# Altium project SPEC_A7.PrjPcb (part 2 of 7)

## Sheet FPGA_14_15.SchDoc: SPEC-A7
size 420 x 297 mm; Author: G.Kasprowicz; CompanyName: WUT ISE; DrawnBy: G.Kasprowicz; Organization: WUT ISE; Address1: PW ISE; Address2: Nowowiejska 15/19 00-665 Warsaw; Address3: gkasprow@gmail.com; Revision: 2; SheetNumber: 3; SheetTotal: 18; ModifiedBy: -; CheckedDate: -; Title2: FPGA 14 &15; DivGrp: WUT ISE; Designer: G.Kasprowicz; ModifiedDate: -; ProjectName: Sensor Box
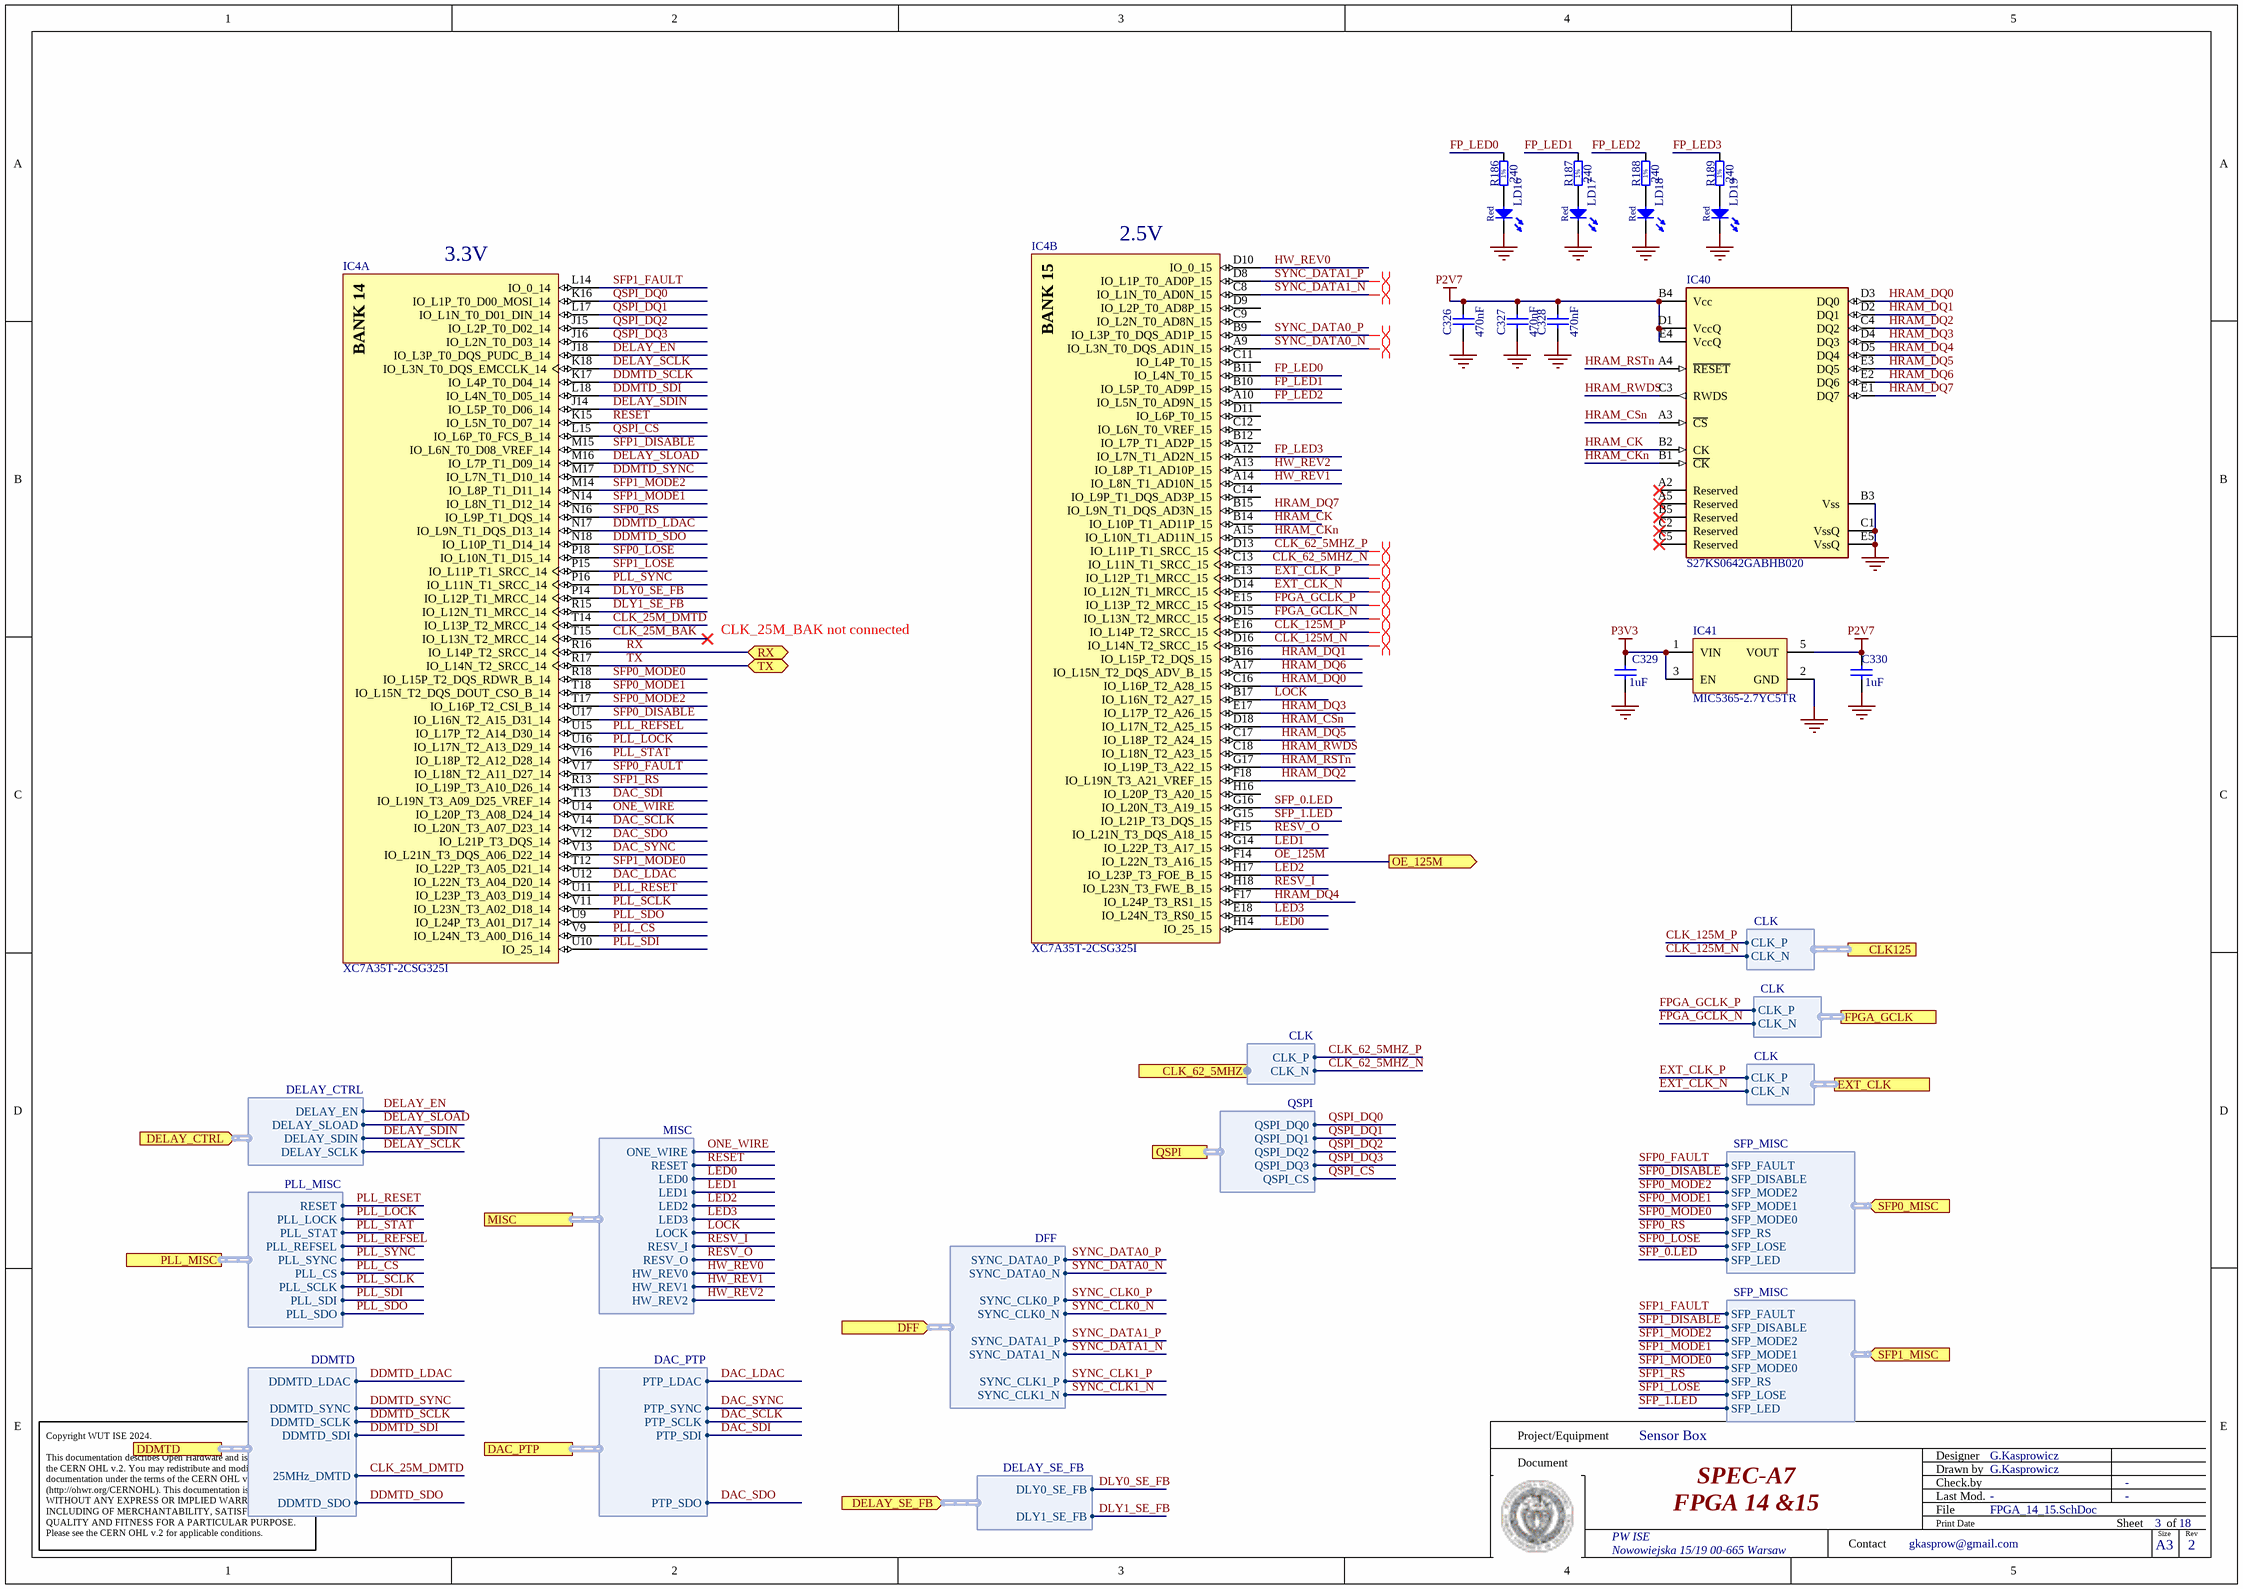
[diagram p2: FPGA_14_15.SchDoc]

### Parts
C326  470nF  [CAPC0603X33N]
C327  470nF  [CAPC0603X33N]
C328  470nF  [CAPC0603X33N]
C329  1uF  [CAPC1005X55N]
C330  1uF  [CAPC1005X55N]
IC4  XC7A35T-2CSG325I  [CSG325]  (parts A,B of 9)
IC40  S27KS0642GABHB020  [FP-PG-BGA-24-IPC_A]
IC41  MIC5365-2.7YC5TR  [SOT65P210X110-5N]
LD16  Red  [LED_AVAGO_HSMC-C120]
LD17  Red  [LED_AVAGO_HSMC-C120]
LD18  Red  [LED_AVAGO_HSMC-C120]
LD19  Red  [LED_AVAGO_HSMC-C120]
R186  240  [RESC1005X40N]
R187  240  [RESC1005X40N]
R188  240  [RESC1005X40N]
R189  240  [RESC1005X40N]

### Ports
CLK125 (harness CLK, see SPEC-A7-TOP[3C], FPGA_MGT[2C]), CLK_62_5MHZ (harness CLK, see SPEC-A7-TOP[3B], Clocks_PLL[5B]), DAC_PTP (harness DAC_PTP, see SPEC-A7-TOP[3C], VCXO_25M_PTP[1C]), DDMTD (harness DDMTD, see SPEC-A7-TOP[3C], VCXO_25M_DDMTD[1D]), DELAY_CTRL (in, harness DELAY_CTRL, see SPEC-A7-TOP[3C], DIFF_DELAY_FANOUT[5B]), DELAY_SE_FB (in, harness DELAY_SE_FB, see SPEC-A7-TOP[3C], DIFF_DELAY_FANOUT[5D]), DFF (in, harness DFF, see SPEC-A7-TOP[3C], Clocks_PLL[3C], DIFF_DELAY_FANOUT[5C]), EXT_CLK (harness CLK, see SPEC-A7-TOP[3B], Clocks_PLL[3B]), FPGA_GCLK (harness CLK, see SPEC-A7-TOP[3B], Clocks_PLL[3B]), MISC (harness MISC, see SPEC-A7-TOP[3C], Misc[2C]), OE_125M (out, see SPEC-A7-TOP[3C], XO_125M[1D]), PLL_MISC (harness PLL_MISC, see SPEC-A7-TOP[3B], Clocks_PLL[5D]), QSPI (harness QSPI, see SPEC-A7-TOP[3C], FPGA_PWR_CONFIG[3E]), RX (bidir, see SPEC-A7-TOP[3C]), SFP0_MISC (in, harness SFP_MISC, see SPEC-A7-TOP[3B], SFP[4B]), SFP1_MISC (in, harness SFP_MISC, see SPEC-A7-TOP[3B], SFP[4C]), TX (bidir, see SPEC-A7-TOP[3C])

### Harnesses
DDMTD: DDMTD_LDAC, DDMTD_SYNC, DDMTD_SCLK, DDMTD_SDI, DDMTD_SDO, 25MHz_DMTD
DAC_PTP: PTP_LDAC, PTP_SYNC, PTP_SCLK, PTP_SDI, PTP_SDO
PLL_MISC: RESET, PLL_LOCK, PLL_STAT, PLL_REFSEL, PLL_SYNC, PLL_CS, PLL_SCLK, PLL_SDI, PLL_SDO
DELAY_CTRL: DELAY_EN, DELAY_SLOAD, DELAY_SDIN, DELAY_SCLK
DFF: SYNC_DATA0_P, SYNC_DATA0_N, SYNC_CLK0_P, SYNC_CLK0_N, SYNC_DATA1_P, SYNC_DATA1_N, SYNC_CLK1_P, SYNC_CLK1_N
DELAY_SE_FB: DLY0_SE_FB, DLY1_SE_FB
MISC: ONE_WIRE, RESET, LED0, LED1, LED2, LED3, LOCK, RESV_I, RESV_O, HW_REV0, HW_REV1, HW_REV2
QSPI: QSPI_DQ0, QSPI_DQ1, QSPI_DQ2, QSPI_DQ3, QSPI_CS
CLK: CLK_P, CLK_N
SFP_MISC: SFP_FAULT, SFP_DISABLE, SFP_MODE2, SFP_MODE1, SFP_MODE0, SFP_RS, SFP_LOSE, SFP_LED

### Nets
GND: C326.1 C327.1 C328.1 C329.1 C330.1 IC40.B3(Vss) IC40.C1(VssQ) IC40.E5(VssQ) IC41.2(GND) LD16.1(C) LD17.1(C) LD18.1(C) LD19.1(C)
P2V7: C326.2 C327.2 C328.2 C330.2 IC40.B4(Vcc) IC40.D1(VccQ) IC40.E4(VccQ) IC41.5(VOUT)
P3V3: C329.2 IC41.1(VIN) IC41.3(EN)
CLK_25M_BAK: IC4.T15(IO_L13N_T2_MRCC_14)
CLK_25M_DMTD: IC4.T14(IO_L13P_T2_MRCC_14) ; port DDMTD.25MHz_DMTD
CLK_62_5MHZ_N: IC4.C13(IO_L11N_T1_SRCC_15) ; port CLK_62_5MHZ.CLK_N  [project net 62_5MHZ_N]
CLK_62_5MHZ_P: IC4.D13(IO_L11P_T1_SRCC_15) ; port CLK_62_5MHZ.CLK_P  [project net 62_5MHZ_P]
CLK_125M_N: IC4.D16(IO_L14N_T2_SRCC_15) ; port CLK125.CLK_N
CLK_125M_P: IC4.E16(IO_L14P_T2_SRCC_15) ; port CLK125.CLK_P
DAC_LDAC: IC4.U12(IO_L22N_T3_A04_D20_14) ; port DAC_PTP.PTP_LDAC
DAC_SCLK: IC4.V14(IO_L20N_T3_A07_D23_14) ; port DAC_PTP.PTP_SCLK
DAC_SDI: IC4.T13(IO_L19N_T3_A09_D25_VREF_14) ; port DAC_PTP.PTP_SDI
DAC_SDO: IC4.V12(IO_L21P_T3_DQS_14) ; port DAC_PTP.PTP_SDO
DAC_SYNC: IC4.V13(IO_L21N_T3_DQS_A06_D22_14) ; port DAC_PTP.PTP_SYNC
DDMTD_LDAC: IC4.N17(IO_L9N_T1_DQS_D13_14) ; port DDMTD.DDMTD_LDAC
DDMTD_SCLK: IC4.K17(IO_L4P_T0_D04_14) ; port DDMTD.DDMTD_SCLK
DDMTD_SDI: IC4.L18(IO_L4N_T0_D05_14) ; port DDMTD.DDMTD_SDI
DDMTD_SDO: IC4.N18(IO_L10P_T1_D14_14) ; port DDMTD.DDMTD_SDO
DDMTD_SYNC: IC4.M17(IO_L7N_T1_D10_14) ; port DDMTD.DDMTD_SYNC
DELAY_EN: IC4.J18(IO_L3P_T0_DQS_PUDC_B_14) ; port DELAY_CTRL.DELAY_EN
DELAY_SCLK: IC4.K18(IO_L3N_T0_DQS_EMCCLK_14) ; port DELAY_CTRL.DELAY_SCLK
DELAY_SDIN: IC4.J14(IO_L5P_T0_D06_14) ; port DELAY_CTRL.DELAY_SDIN
DELAY_SLOAD: IC4.M16(IO_L7P_T1_D09_14) ; port DELAY_CTRL.DELAY_SLOAD
DLY0_SE_FB: IC4.P14(IO_L12P_T1_MRCC_14) ; port DELAY_SE_FB.DLY0_SE_FB
DLY1_SE_FB: IC4.R15(IO_L12N_T1_MRCC_14) ; port DELAY_SE_FB.DLY1_SE_FB
EXT_CLK_N: IC4.D14(IO_L12N_T1_MRCC_15) ; port EXT_CLK.CLK_N
EXT_CLK_P: IC4.E13(IO_L12P_T1_MRCC_15) ; port EXT_CLK.CLK_P
FP_LED0: IC4.B11(IO_L4N_T0_15) R186.2
FP_LED1: IC4.B10(IO_L5P_T0_AD9P_15) R187.2
FP_LED2: IC4.A10(IO_L5N_T0_AD9N_15) R188.2
FP_LED3: IC4.A12(IO_L7N_T1_AD2N_15) R189.2
FPGA_GCLK_N: IC4.D15(IO_L13N_T2_MRCC_15) ; port FPGA_GCLK.CLK_N
FPGA_GCLK_P: IC4.E15(IO_L13P_T2_MRCC_15) ; port FPGA_GCLK.CLK_P
HRAM_CK: IC4.B14(IO_L10P_T1_AD11P_15) IC40.B2(CK)
HRAM_CKn: IC4.A15(IO_L10N_T1_AD11N_15) IC40.B1(~{CK})
HRAM_CSn: IC4.D18(IO_L17N_T2_A25_15) IC40.A3(~{CS})
HRAM_DQ0: IC4.C16(IO_L16P_T2_A28_15) IC40.D3(DQ0)
HRAM_DQ1: IC4.B16(IO_L15P_T2_DQS_15) IC40.D2(DQ1)
HRAM_DQ2: IC4.F18(IO_L19N_T3_A21_VREF_15) IC40.C4(DQ2)
HRAM_DQ3: IC4.E17(IO_L17P_T2_A26_15) IC40.D4(DQ3)
HRAM_DQ4: IC4.F17(IO_L24P_T3_RS1_15) IC40.D5(DQ4)
HRAM_DQ5: IC4.C17(IO_L18P_T2_A24_15) IC40.E3(DQ5)
HRAM_DQ6: IC4.A17(IO_L15N_T2_DQS_ADV_B_15) IC40.E2(DQ6)
HRAM_DQ7: IC4.B15(IO_L9N_T1_DQS_AD3N_15) IC40.E1(DQ7)
HRAM_RSTn: IC4.G17(IO_L19P_T3_A22_15) IC40.A4(~{RESET})
HRAM_RWDS: IC4.C18(IO_L18N_T2_A23_15) IC40.C3(RWDS)
HW_REV0: IC4.D10(IO_0_15) ; port MISC.HW_REV0
HW_REV1: IC4.A14(IO_L8N_T1_AD10N_15) ; port MISC.HW_REV1
HW_REV2: IC4.A13(IO_L8P_T1_AD10P_15) ; port MISC.HW_REV2
LED0: IC4.H14(IO_25_15) ; port MISC.LED0
LED1: IC4.G14(IO_L22P_T3_A17_15) ; port MISC.LED1
LED2: IC4.H17(IO_L23P_T3_FOE_B_15) ; port MISC.LED2
LED3: IC4.E18(IO_L24N_T3_RS0_15) ; port MISC.LED3
LOCK: IC4.B17(IO_L16N_T2_A27_15) ; port MISC.LOCK
OE_125M: IC4.F14(IO_L22N_T3_A16_15) ; port OE_125M
ONE_WIRE: IC4.U14(IO_L20P_T3_A08_D24_14) ; port MISC.ONE_WIRE
PLL_CS: IC4.V9(IO_L24N_T3_A00_D16_14) ; port PLL_MISC.PLL_CS
PLL_LOCK: IC4.U16(IO_L17N_T2_A13_D29_14) ; port PLL_MISC.PLL_LOCK
PLL_REFSEL: IC4.U15(IO_L17P_T2_A14_D30_14) ; port PLL_MISC.PLL_REFSEL
PLL_RESET: IC4.U11(IO_L23P_T3_A03_D19_14) ; port PLL_MISC.RESET
PLL_SCLK: IC4.V11(IO_L23N_T3_A02_D18_14) ; port PLL_MISC.PLL_SCLK
PLL_SDI: IC4.U10(IO_25_14) ; port PLL_MISC.PLL_SDI
PLL_SDO: IC4.U9(IO_L24P_T3_A01_D17_14) ; port PLL_MISC.PLL_SDO
PLL_STAT: IC4.V16(IO_L18P_T2_A12_D28_14) ; port PLL_MISC.PLL_STAT
PLL_SYNC: IC4.P16(IO_L11N_T1_SRCC_14) ; port PLL_MISC.PLL_SYNC
QSPI_CS: IC4.L15(IO_L6P_T0_FCS_B_14) ; port QSPI.QSPI_CS
QSPI_DQ0: IC4.K16(IO_L1P_T0_D00_MOSI_14) ; port QSPI.QSPI_DQ0
QSPI_DQ1: IC4.L17(IO_L1N_T0_D01_DIN_14) ; port QSPI.QSPI_DQ1
QSPI_DQ2: IC4.J15(IO_L2P_T0_D02_14) ; port QSPI.QSPI_DQ2
QSPI_DQ3: IC4.J16(IO_L2N_T0_D03_14) ; port QSPI.QSPI_DQ3
RESET: IC4.K15(IO_L5N_T0_D07_14) ; port MISC.RESET
RESV_I: IC4.H18(IO_L23N_T3_FWE_B_15) ; port MISC.RESV_I
RESV_O: IC4.F15(IO_L21N_T3_DQS_A18_15) ; port MISC.RESV_O
RX: IC4.R16(IO_L14P_T2_SRCC_14) ; port RX
SFP0_DISABLE: IC4.U17(IO_L16N_T2_A15_D31_14) ; port SFP0_MISC.SFP_DISABLE
SFP0_FAULT: IC4.V17(IO_L18N_T2_A11_D27_14) ; port SFP0_MISC.SFP_FAULT
SFP0_LOSE: IC4.P18(IO_L10N_T1_D15_14) ; port SFP0_MISC.SFP_LOSE
SFP0_MODE0: IC4.R18(IO_L15P_T2_DQS_RDWR_B_14) ; port SFP0_MISC.SFP_MODE0
SFP0_MODE1: IC4.T18(IO_L15N_T2_DQS_DOUT_CSO_B_14) ; port SFP0_MISC.SFP_MODE1
SFP0_MODE2: IC4.T17(IO_L16P_T2_CSI_B_14) ; port SFP0_MISC.SFP_MODE2
SFP0_RS: IC4.N16(IO_L9P_T1_DQS_14) ; port SFP0_MISC.SFP_RS
SFP1_DISABLE: IC4.M15(IO_L6N_T0_D08_VREF_14) ; port SFP1_MISC.SFP_DISABLE
SFP1_FAULT: IC4.L14(IO_0_14) ; port SFP1_MISC.SFP_FAULT
SFP1_LOSE: IC4.P15(IO_L11P_T1_SRCC_14) ; port SFP1_MISC.SFP_LOSE
SFP1_MODE0: IC4.T12(IO_L22P_T3_A05_D21_14) ; port SFP1_MISC.SFP_MODE0
SFP1_MODE1: IC4.N14(IO_L8N_T1_D12_14) ; port SFP1_MISC.SFP_MODE1
SFP1_MODE2: IC4.M14(IO_L8P_T1_D11_14) ; port SFP1_MISC.SFP_MODE2
SFP1_RS: IC4.R13(IO_L19P_T3_A10_D26_14) ; port SFP1_MISC.SFP_RS
SFP_0.LED: IC4.G16(IO_L20N_T3_A19_15) ; port SFP0_MISC.SFP_LED
SFP_1.LED: IC4.G15(IO_L21P_T3_DQS_15) ; port SFP1_MISC.SFP_LED
SYNC_DATA0_N: IC4.A9(IO_L3N_T0_DQS_AD1N_15) ; port DFF.SYNC_DATA0_N
SYNC_DATA0_P: IC4.B9(IO_L3P_T0_DQS_AD1P_15) ; port DFF.SYNC_DATA0_P
SYNC_DATA1_N: IC4.C8(IO_L1N_T0_AD0N_15) ; port DFF.SYNC_DATA1_N
SYNC_DATA1_P: IC4.D8(IO_L1P_T0_AD0P_15) ; port DFF.SYNC_DATA1_P
TX: IC4.R17(IO_L14N_T2_SRCC_14) ; port TX
NetLD16_2: LD16.2(A) R186.1
NetLD17_2: LD17.2(A) R187.1
NetLD18_2: LD18.2(A) R188.1
NetLD19_2: LD19.2(A) R189.1

Not connected (* = marked no-connect by the designer): IC4 B12(IO_L7P_T1_AD2P_15) C9(IO_L2N_T0_AD8N_15) C11(IO_L4P_T0_15) C12(IO_L6N_T0_VREF_15) C14(IO_L9P_T1_DQS_AD3P_15) D9(IO_L2P_T0_AD8P_15) D11(IO_L6P_T0_15) H16(IO_L20P_T3_A20_15); IC40 A2(Reserved)* A5(Reserved)* B5(Reserved)* C2(Reserved)* C5(Reserved)*

### Layout directives
differential pair: 62_5MHZ_N, 62_5MHZ_P, CLK_125M_N, CLK_125M_P, EXT_CLK_N, EXT_CLK_P, FPGA_GCLK_N, FPGA_GCLK_P, SYNC_DATA0_N, SYNC_DATA0_P, SYNC_DATA1_N, SYNC_DATA1_P

### Notes on the sheet
- 3.3V
- 2.5V
- CLK_25M_BAK not connected
- Project/Equipment
- Document
- Designer
- Drawn by
- Check.by
- Copyright WUT ISE 2024.
  This documentation describes Open Hardware and is licensed under the CERN OHL v.2. You may redistribute and modify this documentation under the terms of the CERN OHL v.2. (http://ohwr.org/CERNOHL). This documentation is distributed WITHOUT ANY EXPRESS OR IMPLIED WARRANTY, INCLUDING OF MERCHANTABILITY, SATISFACTORY QUALITY AND FITNESS FOR A PARTICULAR PURPOSE. Please see the CERN OHL v.2 for applicable conditions.
- Contact
- File
- Last Mod.
- Print Date
- Sheet
- Size
- A3
- of
- Rev
- (in symbol CMP-0383-00003-1, part A) BANK 14
- (in symbol CMP-0383-00003-1, part B) BANK 15
- (in symbol R0402_240R_1%_0.0625W_100PPM) 1%

### Library data of the parts
C326-C328 = CC0201_470NF_4V_20%_X5R: as C233 on sheet Clocks_PLL; Part Number: CC0201_470NF_4V_20%_X5R; Component Kind: Standard; Component Type: Standard; Pin Count: 2; Value: 470nF; Status: Not Recommended; Manufacturer Part Number: CC0201_470NF_4V_20%_X5R; Case: 0201; Mounted: Yes; Socket: No; SMD: Yes; Sense: No; Manufacturer1 Example: TAIYO YUDEN; Manufacturer1 ComponentHeight: 0.33mm; HelpURL: \\cern.ch\dfs\Applications\Altium\Datasheets\CC0201_X5R_TAIYO-YUDEN_STANDARD-CLASS2.pdf; Author: CERN DEM JLC; CreateDate: 27.05.2010; LatestRevisionDate: 27.05.2010
C329 C330 = CC0402_1UF_16V_10%_X5R: as C225 on sheet Clocks_PLL; Part Number: CC0402_1UF_16V_10%_X5R; Component Kind: Standard; Component Type: Standard; Pin Count: 2; Value: 1uF; Status: Preferred; Manufacturer Part Number: CC0402_1UF_16V_10%_X5R; Case: 0402; Mounted: Yes; Socket: No; SMD: Yes; Sense: No; Manufacturer1 Example: TDK; Manufacturer1 ComponentHeight: 0.55mm; HelpURL: \\cern.ch\dfs\Applications\Altium\Datasheets\CC0402_X5R_TDK_C.pdf; Author: CERN DEM JLC; CreateDate: 25.10.2012; LatestRevisionDate: 25.10.2012
IC4 = CMP-0383-00003-1: Artix-7 FPGA, 150 User I/Os, 4 GTP, 324-Ball BGA, Speed Grade 2, Industrial Grade, Pb-Free; Manufacturer: Xilinx; Available User I/O: 150; Speed Grades: 2; GTP: 4; Logic Cells: 33280; Total Block RAM: 1800 Kb; CMTs: 5; ComponentLink3URL: http://www.xilinx.com/support/documentation/user_guides/ug475_7Series_Pkg_Pinout.pdf; Maximum Distributed RAM: 400 Kb; Operating Temperature Range: Industrial; ComponentLink1URL: http://www.xilinx.com/; Mounting Technology: Surface Mount; ComponentLink1Description: Manufacturer URL; ComponentLink2Description: Datasheet; PartNumber: XC7A35T-2CSG325I; PackageVersion: Rev. 1.11; PackageDescription: 324-Ball Wire-Bond Chip-Scale BGA, Body 15 x 15 mm, Pitch 0.8 mm; DatasheetVersion: Rev. 1.15; PackageReference: CSG-325; ComponentLink3Description: Pinout; ComponentLink4Description: Package Specification; ComponentLink2URL: http://www.xilinx.com/support/documentation/data_sheets/ds180_7Series_Overview.pdf; ComponentLink4URL: http://www.xilinx.com/support/documentation/user_guides/ug475_7Series_Pkg_Pinout.pdf
IC40 = CMP-32844-000028-1: IC PSRAM 64MBIT HYPERBUS 24FBGA
LD16-LD19 = LED_AVAGO_HSMC-C120: LED Red 1C 2A; Part Description: High Performance Right Angle Chip Red LED; Manufacturer: AVAGO TECHNOLOGIES; PressFit: No; Bonding: No; Part Number: LED_AVAGO_HSMC-C120; Component Kind: Standard; Component Type: Standard; Color: Red; PackageDescription: Red Chip LED, 2-Leads, Body 1.7x1.1mm, Side Emitting Package; Manufacturer Part Number: HSMC-C120; Pin Count: 2; Mounted: Yes; Socket: No; SMD: Yes; Sense: No; ComponentHeight: 0.7mm; HelpURL: \\cern.ch\dfs\Applications\Altium\Datasheets\LED_AVAGO_HSMC-C120.pdf; ComponentLink1URL: \\cern.ch\dfs\Applications\Altium\Datasheets\LED_AVAGO_HSMC-C120_DESIGN-GUIDE.pdf; ComponentLink1Description: Design Guide; Author: CERN DEM JMW; CreateDate: 22.07.2009; LatestRevisionDate: 20.06.2012
R186-R189 = R0402_240R_1%_0.0625W_100PPM: Resistor - 1%; Part Description: General Purpose Thick Film Chip Resistor; Manufacturer: GENERIC; Manufacturer1 Part Number: 232270672401L; TC: ±100ppm/°C; PressFit: No; Part Number: R0402_240R_1%_0.0625W_100PPM; Component Kind: Standard; Component Type: Standard; Pin Count: 2; Value: 240; Status: Not Recommended; Power: 0.0625W; Tolerance: ±1%; Manufacturer Part Number: R0402_240R_1%_0.0625W_100PPM; Case: 0402; Mounted: Yes; Sense: No; Socket: No; SMD: Yes; Manufacturer1 Example: YAGEO PHYCOMP; Manufacturer1 ComponentHeight: 0.4mm; HelpURL: \\cern.ch\dfs\Applications\Altium\Datasheets\R0402_Phycomp_RC0402.pdf; Author: CERN DEM JLC; CreateDate: 03.12.2007; LatestRevisionDate: 17.10.2012

## Sheet DIFF_DELAY_FANOUT.SchDoc: SPEC-A7
size 420 x 297 mm; Author: G.Kasprowicz; CompanyName: WUT ISE; DrawnBy: G.Kasprowicz; Organization: WUT ISE; Address1: PW ISE; Address2: Nowowiejska 15/19 00-665 Warsaw; Address3: gkasprow@gmail.com; Revision: 2; SheetNumber: 11; SheetTotal: 18; ModifiedBy: -; CheckedDate: -; Title2: Delay & outputs; DivGrp: WUT ISE; Designer: G.Kasprowicz; ModifiedDate: -; ProjectName: Sensor Box
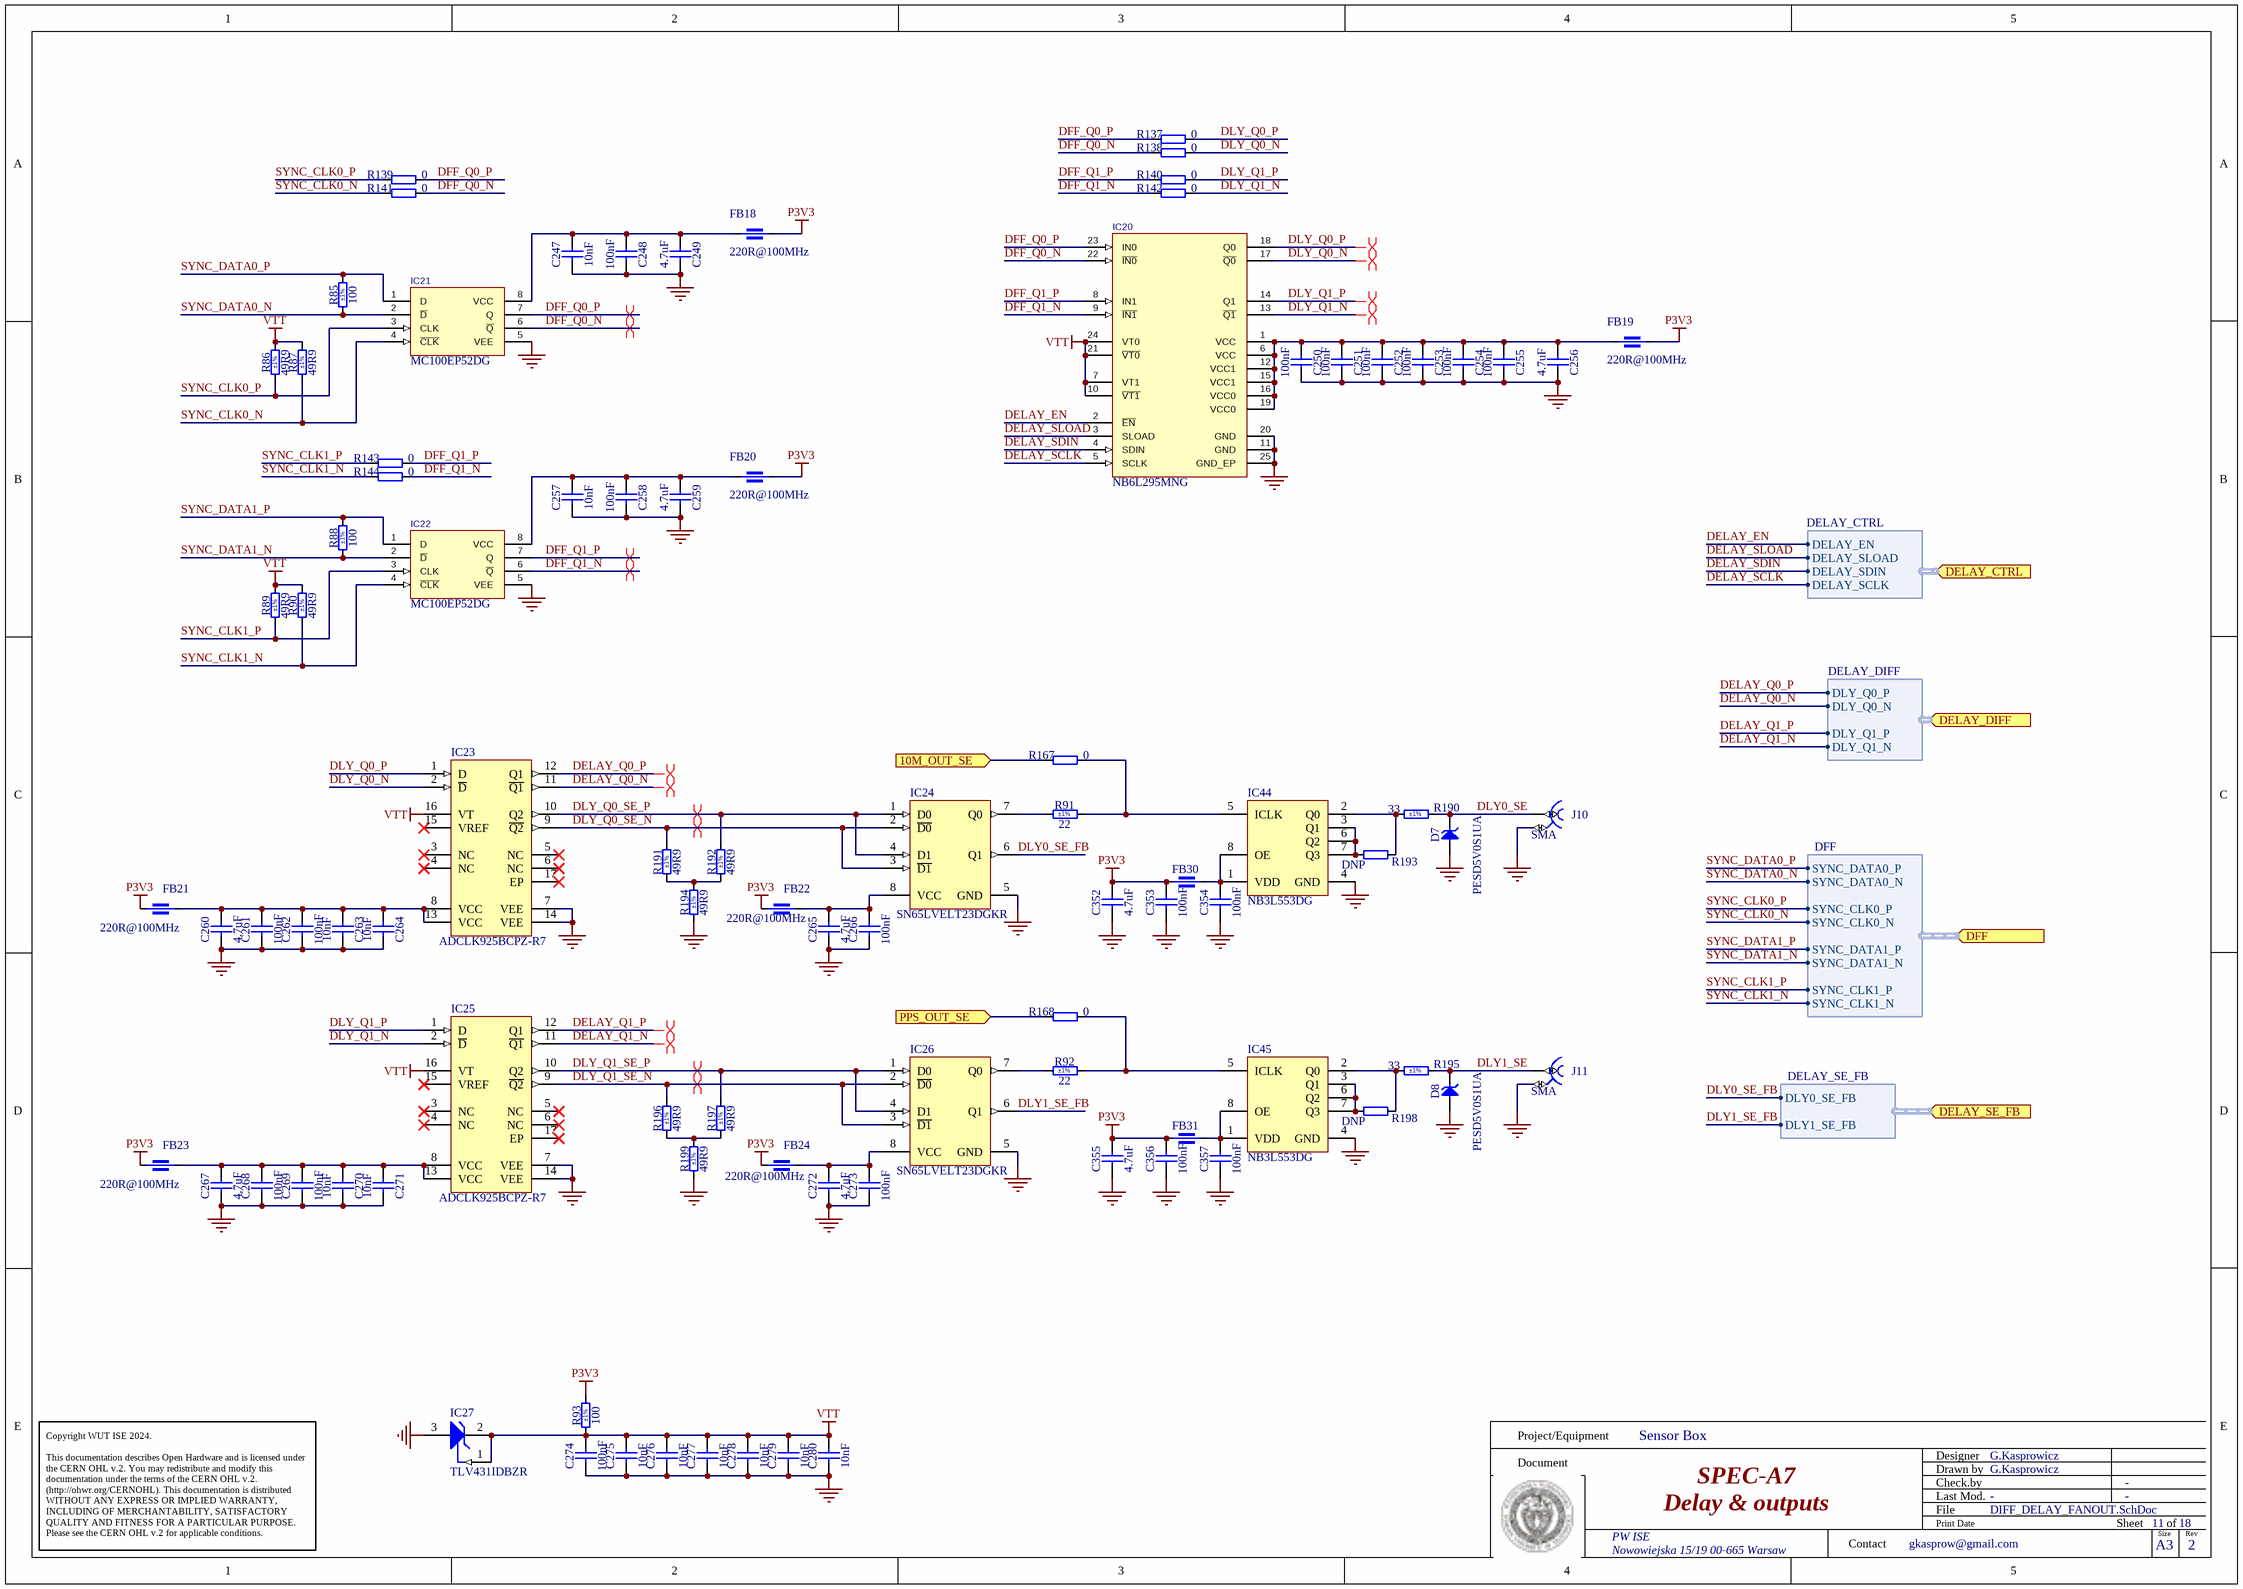
[diagram p3: DIFF_DELAY_FANOUT.SchDoc]

### Parts
C247  10nF  [CAPC1005X55N]
C248  100nF  [CAPC0603X33N]
C249  4.7uF  [CAPC1005X55N]
C250  100nF  [CAPC0603X33N]
C251  100nF  [CAPC0603X33N]
C252  100nF  [CAPC0603X33N]
C253  100nF  [CAPC0603X33N]
C254  100nF  [CAPC0603X33N]
C255  100nF  [CAPC0603X33N]
C256  4.7uF  [CAPC1005X55N]
C257  10nF  [CAPC1005X55N]
C258  100nF  [CAPC0603X33N]
C259  4.7uF  [CAPC1005X55N]
C260  4.7uF  [CAPC1005X55N]
C261  100nF  [CAPC0603X33N]
C262  100nF  [CAPC0603X33N]
C263  10nF  [CAPC1005X55N]
C264  10nF  [CAPC1005X55N]
C265  4.7uF  [CAPC1005X55N]
C266  100nF  [CAPC0603X33N]
C267  4.7uF  [CAPC1005X55N]
C268  100nF  [CAPC0603X33N]
C269  100nF  [CAPC0603X33N]
C270  10nF  [CAPC1005X55N]
C271  10nF  [CAPC1005X55N]
C272  4.7uF  [CAPC1005X55N]
C273  100nF  [CAPC0603X33N]
C274  100nF  [CAPC0603X33N]
C275  10nF  [CAPC1005X55N]
C276  10nF  [CAPC1005X55N]
C277  10nF  [CAPC1005X55N]
C278  10nF  [CAPC1005X55N]
C279  10nF  [CAPC1005X55N]
C280  10nF  [CAPC1005X55N]
C352  4.7uF  [CAPC1005X55N]
C353  100nF  [CAPC0603X33N]
C354  100nF  [CAPC0603X33N]
C355  4.7uF  [CAPC1005X55N]
C356  100nF  [CAPC0603X33N]
C357  100nF  [CAPC0603X33N]
D7  PESD5V0S1UA  [SOD2512X110N]
D8  PESD5V0S1UA  [SOD2512X110N]
FB18  220R@100MHz  [INDC1608X95N]
FB19  220R@100MHz  [INDC1608X95N]
FB20  220R@100MHz  [INDC1608X95N]
FB21  220R@100MHz  [INDC1608X95N]
FB22  220R@100MHz  [INDC1608X95N]
FB23  220R@100MHz  [INDC1608X95N]
FB24  220R@100MHz  [INDC1608X95N]
FB30  220R@100MHz  [INDC1608X95N]  (value not drawn)
FB31  220R@100MHz  [INDC1608X95N]  (value not drawn)
IC20  NB6L295MNG  [QFN50P400X400X80-25N-S280]
IC21  MC100EP52DG  [SOIC127P600X175-8N]
IC22  MC100EP52DG  [SOIC127P600X175-8N]
IC23  ADCLK925BCPZ-R7  [ADI-CP-16-3_L]
IC24  SN65LVELT23DGKR  [DGK0008A_L]
IC25  ADCLK925BCPZ-R7  [ADI-CP-16-3_L]
IC26  SN65LVELT23DGKR  [DGK0008A_L]
IC27  TLV431IDBZR  [DBZ0003A_N]
IC44  NB3L553DG  [SOIC127P600X175-8N]
IC45  NB3L553DG  [SOIC127P600X175-8N]
J10  SMA  [DELOCK_65848]
J11  SMA  [DELOCK_65848]
R85  100  Tolerance: ±1%  [RESC1005X40N]
R86  49R9  Tolerance: ±1%  [RESC1005X40N]
R87  49R9  Tolerance: ±1%  [RESC1005X40N]
R88  100  Tolerance: ±1%  [RESC1005X40N]
R89  49R9  Tolerance: ±1%  [RESC1005X40N]
R90  49R9  Tolerance: ±1%  [RESC1005X40N]
R91  22  Tolerance: ±1%  [RESC1005X40N]
R92  22  Tolerance: ±1%  [RESC1005X40N]
R93  100  Tolerance: ±1%  [RESC1005X40N]
R137  0  [RESC1005X40N]  (no BOM)
R138  0  [RESC1005X40N]  (no BOM)
R139  0  [RESC1005X40N]  (no BOM)
R140  0  [RESC1005X40N]  (no BOM)
R141  0  [RESC1005X40N]  (no BOM)
R142  0  [RESC1005X40N]  (no BOM)
R143  0  [RESC1005X40N]  (no BOM)
R144  0  [RESC1005X40N]  (no BOM)
R167  0  [RESC1005X40N]  (no BOM)
R168  0  [RESC1005X40N]  (no BOM)
R190  33  Tolerance: ±1%  [RESC2012X60N]
R191  49R9  Tolerance: ±1%  [RESC1005X40N]
R192  49R9  Tolerance: ±1%  [RESC1005X40N]
R193  DNP  [RESC1005X40N]  (no BOM)
R194  49R9  Tolerance: ±1%  [RESC1005X40N]
R195  33  Tolerance: ±1%  [RESC2012X60N]
R196  49R9  Tolerance: ±1%  [RESC1005X40N]
R197  49R9  Tolerance: ±1%  [RESC1005X40N]
R198  DNP  [RESC1005X40N]  (no BOM)
R199  49R9  Tolerance: ±1%  [RESC1005X40N]

### Ports
10M_OUT_SE (in, see SPEC-A7-TOP[2C], FPGA_34[2C]), DELAY_CTRL (in, harness DELAY_CTRL, see SPEC-A7-TOP[2C], FPGA_14_15[1D]), DELAY_DIFF (in, harness DELAY_DIFF, see SPEC-A7-TOP[2C], Ext_connectors[2C]), DELAY_SE_FB (in, harness DELAY_SE_FB, see SPEC-A7-TOP[2C], FPGA_14_15[2E]), DFF (in, harness DFF, see SPEC-A7-TOP[2C], Clocks_PLL[3C], FPGA_14_15[2E]), PPS_OUT_SE (in, see SPEC-A7-TOP[2C], FPGA_34[2C])

### Harnesses
DFF: SYNC_DATA0_P, SYNC_DATA0_N, SYNC_CLK0_P, SYNC_CLK0_N, SYNC_DATA1_P, SYNC_DATA1_N, SYNC_CLK1_P, SYNC_CLK1_N
DELAY_DIFF: DLY_Q0_P, DLY_Q0_N, DLY_Q1_P, DLY_Q1_N
DELAY_CTRL: DELAY_EN, DELAY_SLOAD, DELAY_SDIN, DELAY_SCLK
DELAY_SE_FB: DLY0_SE_FB, DLY1_SE_FB

### Nets
GND: C247.1 C248.1 C249.1 C250.1 C251.1 C252.1 C253.1 C254.1 C255.1 C256.1 C257.1 C258.1 C259.1 C260.1 C261.1 C262.1 C263.1 C264.1 C265.1 C266.1 C267.1 C268.1 C269.1 C270.1 C271.1 C272.1 C273.1 C274.1 C275.1 C276.1 C277.1 C278.1 C279.1 C280.1 C352.1 C353.1 C354.1 C355.1 C356.1 C357.1 D7.2(A) D8.2(A) IC20.11(GND) IC20.20(GND) IC20.25(GND_EP) IC21.5(VEE) IC22.5(VEE) IC23.7(VEE) IC23.14(VEE) IC24.5(GND) IC25.7(VEE) IC25.14(VEE) IC26.5(GND) IC27.3(ANODE) IC44.4(GND) IC45.4(GND) J10.2 J11.2 R194.1 R199.1
P3V3: C352.2 C353.2 C355.2 C356.2 FB18.1 FB19.1 FB20.1 FB21.1 FB22.1 FB23.1 FB24.1 FB30.1 FB31.1 R93.2
VTT: C274.2 C275.2 C276.2 C277.2 C278.2 C279.2 C280.2 IC20.7(VT1) IC20.10(~{VT1}) IC20.21(~{VT0}) IC20.24(VT0) IC23.16(VT) IC25.16(VT) IC27.1(REF) IC27.2(CATHODE) R86.2 R87.2 R89.2 R90.2 R93.1
10M_OUT_SE: R167.1 ; port 10M_OUT_SE
DELAY_EN: IC20.2(~{EN}) ; port DELAY_CTRL.DELAY_EN
DELAY_Q0_N: IC23.11(~{Q1}) ; port DELAY_DIFF.DLY_Q0_N
DELAY_Q0_P: IC23.12(Q1) ; port DELAY_DIFF.DLY_Q0_P
DELAY_Q1_N: IC25.11(~{Q1}) ; port DELAY_DIFF.DLY_Q1_N
DELAY_Q1_P: IC25.12(Q1) ; port DELAY_DIFF.DLY_Q1_P
DELAY_SCLK: IC20.5(SCLK) ; port DELAY_CTRL.DELAY_SCLK
DELAY_SDIN: IC20.4(SDIN) ; port DELAY_CTRL.DELAY_SDIN
DELAY_SLOAD: IC20.3(SLOAD) ; port DELAY_CTRL.DELAY_SLOAD
DFF_Q0_N: IC20.22(~{IN0}) IC21.6(~{Q}) R138.1 R141.2
DFF_Q0_P: IC20.23(IN0) IC21.7(Q) R137.1 R139.2
DFF_Q1_N: IC20.9(~{IN1}) IC22.6(~{Q}) R142.1 R144.2
DFF_Q1_P: IC20.8(IN1) IC22.7(Q) R140.1 R143.2
DLY0_SE: D7.1(C) J10.1 R190.1
DLY0_SE_FB: IC24.6(Q1) ; port DELAY_SE_FB.DLY0_SE_FB
DLY1_SE: D8.1(C) J11.1 R195.1
DLY1_SE_FB: IC26.6(Q1) ; port DELAY_SE_FB.DLY1_SE_FB
DLY_Q0_N: IC20.17(~{Q0}) IC23.2(~{D}) R138.2
DLY_Q0_P: IC20.18(Q0) IC23.1(D) R137.2
DLY_Q0_SE_N: IC23.9(~{Q2}) IC24.2(~{D0}) IC24.3(~{D1}) R191.2
DLY_Q0_SE_P: IC23.10(Q2) IC24.1(D0) IC24.4(D1) R192.2
DLY_Q1_N: IC20.13(~{Q1}) IC25.2(~{D}) R142.2
DLY_Q1_P: IC20.14(Q1) IC25.1(D) R140.2
DLY_Q1_SE_N: IC25.9(~{Q2}) IC26.2(~{D0}) IC26.3(~{D1}) R196.2
DLY_Q1_SE_P: IC25.10(Q2) IC26.1(D0) IC26.4(D1) R197.2
PPS_OUT_SE: R168.1 ; port PPS_OUT_SE
SYNC_CLK0_N: IC21.4(~{CLK}) R87.1 R141.1 ; port DFF.SYNC_CLK0_N  [project net OUT_2_N]
SYNC_CLK0_P: IC21.3(CLK) R86.1 R139.1 ; port DFF.SYNC_CLK0_P  [project net OUT_2_P]
SYNC_CLK1_N: IC22.4(~{CLK}) R90.1 R144.1 ; port DFF.SYNC_CLK1_N  [project net OUT_3_N]
SYNC_CLK1_P: IC22.3(CLK) R89.1 R143.1 ; port DFF.SYNC_CLK1_P  [project net OUT_3_P]
SYNC_DATA0_N: IC21.2(~{D}) R85.1 ; port DFF.SYNC_DATA0_N
SYNC_DATA0_P: IC21.1(D) R85.2 ; port DFF.SYNC_DATA0_P
SYNC_DATA1_N: IC22.2(~{D}) R88.1 ; port DFF.SYNC_DATA1_N
SYNC_DATA1_P: IC22.1(D) R88.2 ; port DFF.SYNC_DATA1_P
NetC247_2: C247.2 C248.2 C249.2 FB18.2 IC21.8(VCC)
NetC250_2: C250.2 C251.2 C252.2 C253.2 C254.2 C255.2 C256.2 FB19.2 IC20.1(VCC) IC20.6(VCC) IC20.12(VCC1) IC20.15(VCC1) IC20.16(VCC0) IC20.19(VCC0)
NetC257_2: C257.2 C258.2 C259.2 FB20.2 IC22.8(VCC)
NetC260_2: C260.2 C261.2 C262.2 C263.2 C264.2 FB21.2 IC23.8(VCC) IC23.13(VCC)
NetC265_2: C265.2 C266.2 FB22.2 IC24.8(VCC)
NetC267_2: C267.2 C268.2 C269.2 C270.2 C271.2 FB23.2 IC25.8(VCC) IC25.13(VCC)
NetC272_2: C272.2 C273.2 FB24.2 IC26.8(VCC)
NetC354_2: C354.2 FB30.2 IC44.1(VDD) IC44.8(OE)
NetC357_2: C357.2 FB31.2 IC45.1(VDD) IC45.8(OE)
NetIC24_7: IC24.7(Q0) R91.1
NetIC26_7: IC26.7(Q0) R92.1
NetIC44_2: IC44.2(Q0) R190.2 R193.1
NetIC44_3: IC44.3(Q1) IC44.6(Q2) IC44.7(Q3) R193.2
NetIC44_5: IC44.5(ICLK) R91.2 R167.2
NetIC45_2: IC45.2(Q0) R195.2 R198.1
NetIC45_3: IC45.3(Q1) IC45.6(Q2) IC45.7(Q3) R198.2
NetIC45_5: IC45.5(ICLK) R92.2 R168.2
NetR191_1: R191.1 R192.1 R194.2
NetR196_1: R196.1 R197.1 R199.2

Not connected (* = marked no-connect by the designer): IC23 3(NC)* 4(NC)* 5(NC)* 6(NC)* 15(VREF)* 17(EP)*; IC25 3(NC)* 4(NC)* 5(NC)* 6(NC)* 15(VREF)* 17(EP)*

### Layout directives
differential pair: DELAY_Q0_N, DELAY_Q0_P, DELAY_Q1_N, DELAY_Q1_P, DFF_Q0_N, DFF_Q0_P, DFF_Q1_N, DFF_Q1_P, DLY_Q0_N, DLY_Q0_P, DLY_Q0_SE_N, DLY_Q0_SE_P, DLY_Q1_N, DLY_Q1_P, DLY_Q1_SE_N, DLY_Q1_SE_P

### Notes on the sheet
- Project/Equipment
- Document
- Designer
- Drawn by
- Check.by
- Copyright WUT ISE 2024.
  This documentation describes Open Hardware and is licensed under the CERN OHL v.2. You may redistribute and modify this documentation under the terms of the CERN OHL v.2. (http://ohwr.org/CERNOHL). This documentation is distributed WITHOUT ANY EXPRESS OR IMPLIED WARRANTY, INCLUDING OF MERCHANTABILITY, SATISFACTORY QUALITY AND FITNESS FOR A PARTICULAR PURPOSE. Please see the CERN OHL v.2 for applicable conditions.
- Contact
- File
- Last Mod.
- Print Date
- Sheet
- Size
- A3
- of
- Rev

### Library data of the parts
C247 C257 C263 C264 C270 C271 C275-C280 = CC0402_10NF_16V_10%_X7R: as C177 on sheet Clocks_PLL; Part Number: CC0402_10NF_16V_10%_X7R; Component Kind: Standard; Component Type: Standard; Pin Count: 2; Value: 10nF; Status: Not Recommended; Manufacturer Part Number: CC0402_10NF_16V_10%_X7R; Case: 0402; Mounted: Yes; Socket: No; SMD: Yes; Sense: No; Manufacturer1 Example: PHYCOMP; Manufacturer1 ComponentHeight: 0.55mm; HelpURL: \\cern.ch\dfs\Applications\Altium\Datasheets\CC0402_X7R_PHYCOMP.pdf; Author: CERN DEM JLC; CreateDate: 03.12.2007; LatestRevisionDate: 03.12.2007
C248 C250-C255 C258 C261 C262 C266 C268 C269 C273 C274 C353 C354 C356 C357 = CC0201_100NF_6.3V_10%_X5R: as C38 on sheet Clocks_PLL; Part Number: CC0201_100NF_6.3V_10%_X5R; Component Kind: Standard; Component Type: Standard; Pin Count: 2; Value: 100nF; Status: Not Recommended; Manufacturer Part Number: CC0201_100NF_6.3V_10%_X5R; Case: 0201; Mounted: Yes; Socket: No; SMD: Yes; Sense: No; Manufacturer1 Example: AVX; Manufacturer1 ComponentHeight: 0.33mm; HelpURL: \\cern.ch\dfs\Applications\Altium\Datasheets\CC0201_X5R_AVX.pdf; Author: CERN DEM JLC; CreateDate: 03.12.2007; LatestRevisionDate: 03.12.2007
C249 C256 C259 C260 C265 C267 C272 C352 C355 = CC0402_4.7UF_6.3V_20%_X5R: as C171 on sheet Clocks_PLL; Part Number: CC0402_4.7UF_6.3V_20%_X5R; Component Kind: Standard; Component Type: Standard; Pin Count: 2; Value: 4.7uF; Status: Preferred; Manufacturer Part Number: CC0402_4.7UF_6.3V_20%_X5R; Case: 0402; Mounted: Yes; Socket: No; SMD: Yes; Sense: No; Manufacturer1 Example: TDK; Manufacturer1 ComponentHeight: 0.65mm; HelpURL: \\cern.ch\dfs\Applications\Altium\Datasheets\CC0402_X5R_TDK_C.pdf; Author: CERN DEM JLC; CreateDate: 03.03.2015; LatestRevisionDate: 03.03.2015
D7 D8 = PESD5V0S1UA: as D5 on sheet Clocks_PLL; Part Number: PESD5V0S1UA; Component Kind: Standard; Component Type: Standard; Device: PESD5V0S1UA; PackageDescription: Small Outline Diode (SOD-323), 1.70mm W X 1.25mm L X 1.10mm H body,  IPC Medium Density; Manufacturer Part Number: PESD5V0S1UA; Pin Count: 2; Case: SOD-323; Mounted: Yes; Socket: No; SMD: Yes; Sense: No; ComponentHeight: 1.1mm; HelpURL: \\cern.ch\dfs\Applications\Altium\Datasheets\PESD5V0S1UA.pdf; Author: CERN DEM JLC; CreateDate: 28.08.2012; LatestRevisionDate: 18.09.2013
FB18-FB24 FB30 FB31 = IND0603_MURATA_BLM18SG221TN1: as FB7 on sheet Clocks_PLL; Part Number: IND0603_MURATA_BLM18SG221TN1; Component Kind: Standard; Component Type: Standard; Pin Count: 2; Value: 220R@100MHz; Manufacturer Part Number: BLM18SG221TN1; Case: 0603; Mounted: Yes; Socket: No; SMD: Yes; Sense: No; ComponentHeight: 0.95mm; HelpURL: \\cern.ch\dfs\Applications\Altium\Datasheets\IND0603_MURATA_BLM18S.pdf; Author: CERN DEM MR; CreateDate: 08.01.2016; LatestRevisionDate: 25.10.2018
IC20 = NB6L295MNG: Manufacturer_Name: onsemi; Reference: IC?; Footprint: QFN50P400X400X100-25N; Datasheet: http://www.onsemi.com/pub/Collateral/NB6L295-D.PDF; Height: 1; Mouser Part Number: 863-NB6L295MNG; Mouser Price/Stock: https://www.mouser.co.uk/ProductDetail/ON-Semiconductor/NB6L295MNG?qs=t2BMfLoP1KTcOfiCXyq1Jw%3D%3D; Manufacturer_Part_Number: NB6L295MNG; Value: NB6L295MNG
IC21 IC22 = MC100EP52DG: Manufacturer_Name: onsemi; Reference: IC; Datasheet: http://www.onsemi.com/pub/Collateral/MC10EP52-D.PDF; Height: 1.75; Mouser Part Number: 863-MC100EP52DG; Mouser Price/Stock: https://www.mouser.co.uk/ProductDetail/onsemi/MC100EP52DG?qs=zorda86t5M%2FLiRmjo16XeQ%3D%3D; Manufacturer_Part_Number: MC100EP52DG; Value: MC100EP52DG
IC23 IC25 = CMP-0288-00092-1: Ultrafast SiGe ECL Clock/Data Buffers, CP-16-3, Pb-Free, 1500 Reel; Inputs: 1; Product Description: Clock Buffer; Outputs: 2; Max f-out (MHz): 6000; +Supply Voltage (V): 3.3; On-Chip VCO or DCO: No; Output Logic: ECL; LVPECL; PECL; ComponentLink1URL: www.analog.com; DatasheetVersion: Rev. 0; Code_JEDEC: MO-220-VEED-2; ComponentLink3Description: Package Specification; PackageDescription: 16-Lead Lead Frame Chip Scale Package [LFCSP_VQ]; ComponentLink3URL: http://www.analog.com/static/imported-files/packages/PKG_PDF/LFCSP(CP)/CP_16_3.pdf; PackageReference: CP-16-3; PackageVersion: Jan-2005; ComponentLink1Description: Manufacturer URL; ComponentLink2URL: http://www.analog.com/static/imported-files/data_sheets/ADCLK905_907_925.pdf; ComponentLink2Description: Datasheet
IC24 IC26 = CMP-0327-00201-3: 600 Mbps 3.3 V Dual Differential LVPECL Buffer to LVTTL Translator, 2 Tx and 2 Rx, -40 to +85 degC, 8-pin VSSOP (DGK), Green (RoHS & no Sb/Br); Manufacturer: Texas Instruments; Part-to-Part Skew(Max)(ps): 200; ICC(Max)(mA): 27; No. of Tx: 2; SubFamily: PECL PHY; xECL: TRUE; Signaling Rate(Mbps): 600; Input Signal: LVPECL, LVDS; ComponentLink3Description: URL Link1; PartNumber: SN65LVELT23DGKR; PackageVersion: revE, May-2006; No. of Rx: 2; ComponentLink1Description: Manufacturer URL; ComponentLink2Description: Datasheet; ComponentLink1URL: http://www.ti.com/; PackageDescription: 8-Pin Thin Small Outline Package 3 x 3 mm Body ,0.65 mm Pitch; DatasheetVersion: SLLS929A; PackageReference: DGK0008A; Eco-Plan: Green (RoHS & no Sb/Br); Output Signal: LVTTL; ComponentLink3URL: SamplesURL:http://www.ti.com/product/sn65lvelt23#samples; ComponentLink2URL: http://www.ti.com/general/docs/lit/getliterature.tsp?genericPartNumber=SN65LVELT23&fileType=pdf; Mounting Technology: Surface Mount
IC27 = CMP-0366-00832-2: Low Voltage Adjustable Precision Shunt Regulator, 39 ppm / degC, 15 mA, -40 to 85 degC, 3-pin SOT-23 (DBZ), Green (RoHS & no Sb/Br); Manufacturer: Texas Instruments; VO Adj(Min)(V): 1.24; Temp Coeff(Typ)(ppm/ degree C): 39; Rating: Catalog; Min Iz for Regulation(uA): 80; VO Adj(Max)(V): 6; Iout/Iz(Max)(mA): 15; Temp Coeff(Max)(ppm/ degree C): 129; SubFamily: Shunt Voltage Reference; Initial Accuracy @ 25/deg C(%): 1.5; Eco-Plan: Green (RoHS & no Sb/Br); PackageDescription: 3-Pin Plastic Small Outline, Body 2.92 x 1.3 mm, Pitch 0.95 mm; PackageReference: DBZ0003A; ComponentLink4Description: URL Link1; ComponentLink3Description: Package Specification; DatasheetVersion: SLVS139T; ComponentLink4URL: Samples URL:http://www.ti.com/product/tlv431; PackageVersion: 4203227/B; ComponentLink3URL: http://www.ti.com/litv/pdf/mpds108a; ComponentLink1URL: http://www.ti.com/; Code_JEDEC: TO-236; ComponentLink2Description: Datasheet; ComponentLink1Description: Manufacturer URL; Mounting Technology: Surface Mount; PartNumber: TLV431IDBZR; ComponentLink2URL: http://www.ti.com/general/docs/lit/getliterature.tsp?genericPartNumber=TLV431&fileType=pdf
J10 J11 = DELOCK_65848: as J7 on sheet Clocks_PLL; Part Number: DELOCK_65848; Component Kind: Standard; Component Type: Standard; Pin Count: 5; Family: SMA; Mounted: Yes; Socket: No; SMD: No; Sense: No; Status: None; Part Description: 50 Ohm Through Hole SMA Right Angle PCB Jack; ComponentHeight: 12.5; HelpURL: \\cern.ch\dfs\Applications\Altium\Datasheets\AMPHENOL_132203-16.pdf; Author: GK; CreateDate: 13.05.2019; LatestRevisionDate: 13.05.2019
R85 R88 R93 = R0402_100R_1%_0.0625W_100PPM: as R57 on sheet Clocks_PLL; Part Number: R0402_100R_1%_0.0625W_100PPM; Component Kind: Standard; Component Type: Standard; Pin Count: 2; Value: 100; Status: Not Recommended; Power: 0.0625W; Manufacturer Part Number: R0402_100R_1%_0.0625W_100PPM; Case: 0402; Mounted: Yes; Sense: No; Socket: No; SMD: Yes; Manufacturer1 Example: YAGEO PHYCOMP; Manufacturer1 ComponentHeight: 0.4mm; HelpURL: \\cern.ch\dfs\Applications\Altium\Datasheets\R0402_Phycomp_RC0402.pdf; Author: CERN DEM JLC; CreateDate: 03.12.2007; LatestRevisionDate: 17.10.2012
R86 R87 R89 R90 R191 R192 R194 R196 R197 R199 = R0402_49R9_1%_0.0625W_100PPM: as R76 on sheet Clocks_PLL; Part Number: R0402_49R9_1%_0.0625W_100PPM; Component Kind: Standard; Component Type: Standard; Pin Count: 2; Value: 49R9; Status: Not Recommended; Power: 0.0625W; Manufacturer Part Number: R0402_49R9_1%_0.0625W_100PPM; Case: 0402; Mounted: Yes; Sense: No; Socket: No; SMD: Yes; Manufacturer1 Example: YAGEO PHYCOMP; Manufacturer1 ComponentHeight: 0.4mm; HelpURL: \\cern.ch\dfs\Applications\Altium\Datasheets\R0402_Phycomp_RC0402.pdf; Author: CERN DEM JLC; CreateDate: 24.10.2012; LatestRevisionDate: 24.10.2012
R91 R92 = R0402_22R_1%_0.0625W_100PPM: Resistor - 1%; Part Description: General Purpose Thick Film Chip Resistor; Manufacturer: GENERIC; Manufacturer1 Part Number: 232270672209L; TC: ±100ppm/°C; PressFit: No; Part Number: R0402_22R_1%_0.0625W_100PPM; Component Kind: Standard; Component Type: Standard; Pin Count: 2; Value: 22; Status: Not Recommended; Power: 0.0625W; Manufacturer Part Number: R0402_22R_1%_0.0625W_100PPM; Case: 0402; Mounted: Yes; Sense: No; Socket: No; SMD: Yes; Manufacturer1 Example: YAGEO PHYCOMP; Manufacturer1 ComponentHeight: 0.4mm; HelpURL: \\cern.ch\dfs\Applications\Altium\Datasheets\R0402_Phycomp_RC0402.pdf; Author: CERN DEM JLC; CreateDate: 03.12.2007; LatestRevisionDate: 17.10.2012
R137-R144 R167 R168 R193 R198 = R0402_0R_JUMPER: as R1 on sheet SPEC-A7-TOP; Part Number: R0402_0R_JUMPER; Component Type: Standard; Pin Count: 2; Status: Not Recommended; Manufacturer Part Number: R0402_0R_JUMPER; Case: 0402; Mounted: Yes; Sense: No; Socket: No; SMD: Yes; Manufacturer1 Example: YAGEO PHYCOMP; Manufacturer1 ComponentHeight: 0.4mm; HelpURL: \\cern.ch\dfs\Applications\Altium\Datasheets\R0402_Phycomp_RC0402.pdf; Author: CERN DEM JLC; CreateDate: 03.12.2007; LatestRevisionDate: 17.10.2012
  R137-R144 R167 R168: Value: 0
  R193 R198: Value: DNP
R190 R195 = R0805_33R_1%_0.125W_100PPM: Resistor - 1%; Part Description: General Purpose Thick Film Chip Resistor; Manufacturer: GENERIC; Manufacturer1 Part Number: NRC10F33R0TRF; PressFit: No; Power: 0.125W; TC: ±100ppm/°C; Part Number: R0805_33R_1%_0.125W_100PPM; Component Kind: Standard; Component Type: Standard; Pin Count: 2; Value: 33; Status: Preferred; Manufacturer Part Number: R0805_33R_1%_0.125W_100PPM; Case: 0805; Mounted: Yes; Sense: No; Socket: No; SMD: Yes; Manufacturer1 Example: NIC COMPONENT; Manufacturer1 ComponentHeight: 0.6mm; HelpURL: \\cern.ch\dfs\Applications\Altium\Datasheets\R0805_NIC_NRC.pdf; Author: CERN DEM JLC; CreateDate: 03.12.2007; LatestRevisionDate: 13.03.2008